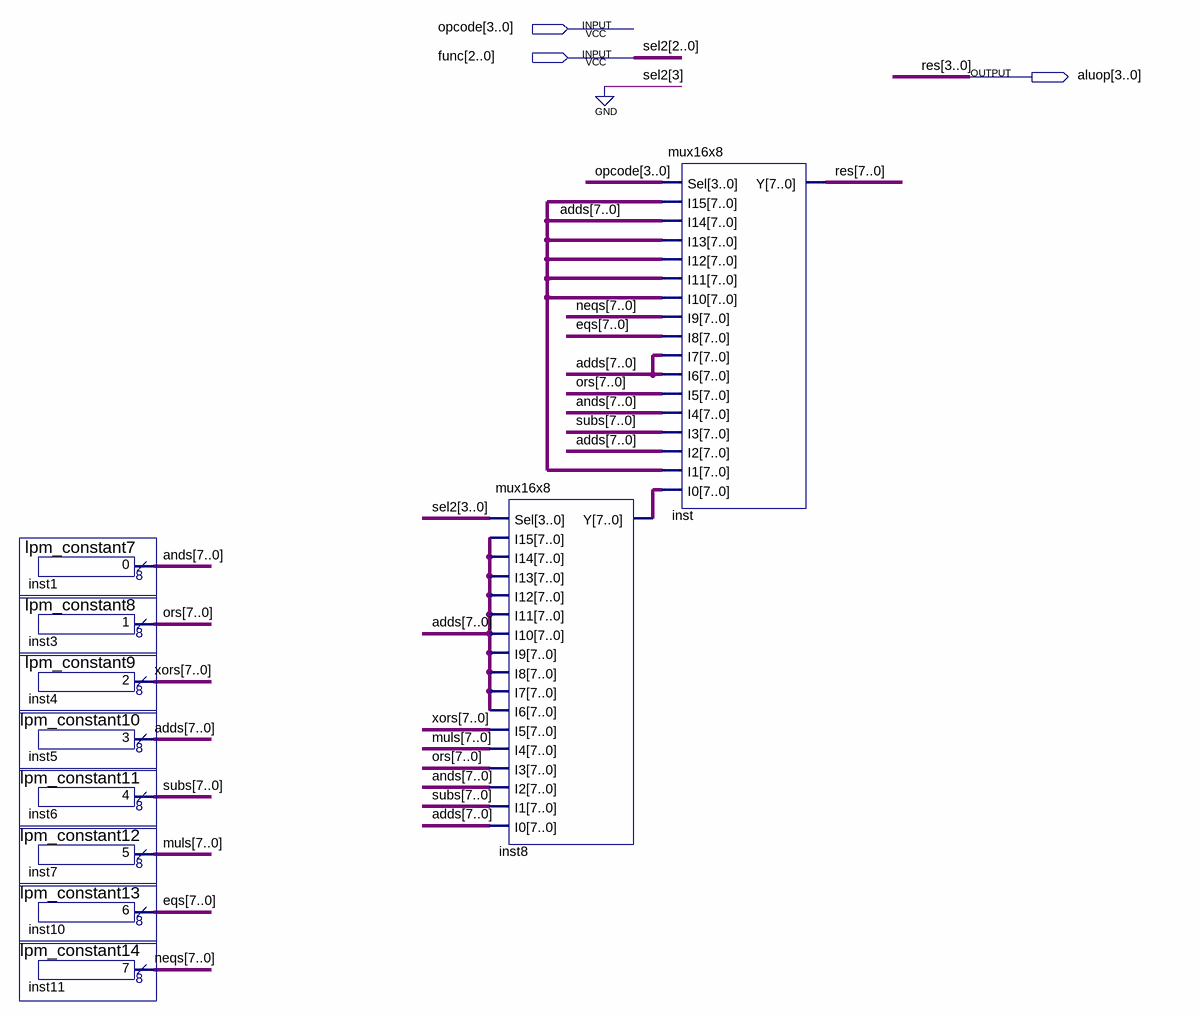
[diagram p0: schematic sheet]
// Quartus schematic aluctrl.bdf as structural Verilog: 10 symbols, 3 pins
module aluctrl (
  input  [3:0] opcode,
  input  [2:0] func,
  output [3:0] aluop
);

  wire [7:0] adds, ands, eqs, inst8_y, muls, neqs, ors, subs, xors;
  wire [7:4] res;

  lpm_constant7 inst1 (.result(ands));
  lpm_constant8 inst3 (.result(ors));
  lpm_constant9 inst4 (.result(xors));
  lpm_constant10 inst5 (.result(adds));
  lpm_constant11 inst6 (.result(subs));
  lpm_constant12 inst7 (.result(muls));
  lpm_constant13 inst10 (.result(eqs));
  lpm_constant14 inst11 (.result(neqs));
  mux16x8 inst8 (
    .Sel({1'b0, func}), .I15(adds), .I14(adds), .I13(adds), .I12(adds), .I11(adds), .I10(adds), .I9(adds),
    .I8(adds), .I7(adds), .I6(adds), .I5(xors), .I4(muls), .I3(ors), .I2(ands), .I1(subs), .I0(adds),
    .Y(inst8_y));
  mux16x8 inst (
    .Sel(opcode), .I15(adds), .I14(adds), .I13(adds), .I12(adds), .I11(adds), .I10(adds), .I9(neqs),
    .I8(eqs), .I7(adds), .I6(adds), .I5(ors), .I4(ands), .I3(subs), .I2(adds), .I1(adds), .I0(inst8_y),
    .Y({res, aluop}));

  // Other names for the same wires on the sheet: res[3:0] = aluop; sel2[2:0] = func
endmodule
